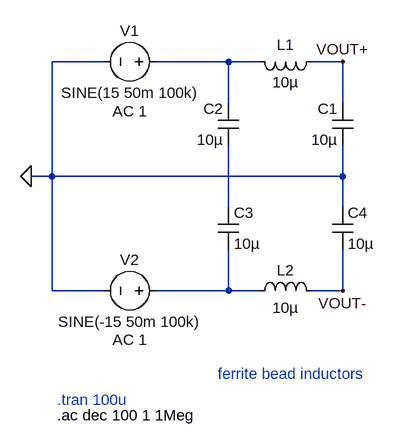
[diagram p0: schematic pifilter.asc]
pifilter.asc, the LTspice schematic file:
Version 4.1
SHEET 1 880 680
WIRE -64 48 -144 48
WIRE 128 48 16 48
WIRE 176 48 128 48
WIRE 304 48 256 48
WIRE 128 112 128 48
WIRE 304 112 304 48
WIRE -144 224 -144 48
WIRE -144 224 -176 224
WIRE 304 224 304 176
WIRE 304 224 -144 224
WIRE 128 272 128 176
WIRE 304 272 304 224
WIRE -144 400 -144 224
WIRE -64 400 -144 400
WIRE 128 400 128 336
WIRE 128 400 16 400
WIRE 176 400 128 400
WIRE 304 400 304 336
WIRE 304 400 256 400
FLAG 304 48 VOUT+
FLAG 304 400 VOUT-
FLAG -176 224 0
SYMBOL ind 272 32 R90
WINDOW 0 5 56 VBottom 2
WINDOW 3 32 56 VTop 2
SYMATTR InstName L1
SYMATTR Value 10µ
SYMATTR SpiceLine Rser=1
SYMBOL cap 320 176 R180
WINDOW 0 24 56 Left 2
WINDOW 3 24 8 Left 2
SYMATTR InstName C1
SYMATTR Value 10µ
SYMATTR SpiceLine Rser=1
SYMBOL cap 144 176 R180
WINDOW 0 24 56 Left 2
WINDOW 3 24 8 Left 2
SYMATTR InstName C2
SYMATTR Value 10µ
SYMATTR SpiceLine Rser=1
SYMBOL ind 160 416 R270
WINDOW 0 32 56 VTop 2
WINDOW 3 5 56 VBottom 2
SYMATTR InstName L2
SYMATTR Value 10µ
SYMATTR SpiceLine Rser=1
SYMBOL cap 112 272 R0
SYMATTR InstName C3
SYMATTR Value 10µ
SYMATTR SpiceLine Rser=1
SYMBOL cap 288 272 R0
SYMATTR InstName C4
SYMATTR Value 10µ
SYMATTR SpiceLine Rser=1
SYMBOL voltage 32 48 R90
WINDOW 0 -32 56 VBottom 2
WINDOW 3 32 56 VTop 2
WINDOW 123 60 56 VTop 2
WINDOW 39 0 0 Left 0
SYMATTR InstName V1
SYMATTR Value SINE(15 50m 100k)
SYMATTR Value2 AC 1
SYMBOL voltage 32 400 R90
WINDOW 0 -32 56 VBottom 2
WINDOW 3 32 56 VTop 2
WINDOW 123 60 56 VTop 2
WINDOW 39 0 0 Left 0
SYMATTR InstName V2
SYMATTR Value SINE(-15 50m 100k)
SYMATTR Value2 AC 1
TEXT -136 568 Left 2 ;.tran 100u
TEXT -136 592 Left 2 !.ac dec 100 1 1Meg
TEXT 112 528 Left 2 ;ferrite bead inductors

The netlist it stands for:
* pifilter.asc
L1 VOUT+ N001 10µ Rser=1
C1 0 VOUT+ 10µ Rser=1
C2 N002 N001 10µ Rser=1
L2 N003 VOUT- 10µ Rser=1
C3 N002 N003 10µ Rser=1
C4 0 VOUT- 10µ Rser=1
V1 N001 0 SINE(15 50m 100k) AC 1
V2 N003 0 SINE(-15 50m 100k) AC 1
* .tran 100u
.ac dec 100 1 1Meg
* ferrite bead inductors
.backanno
.end